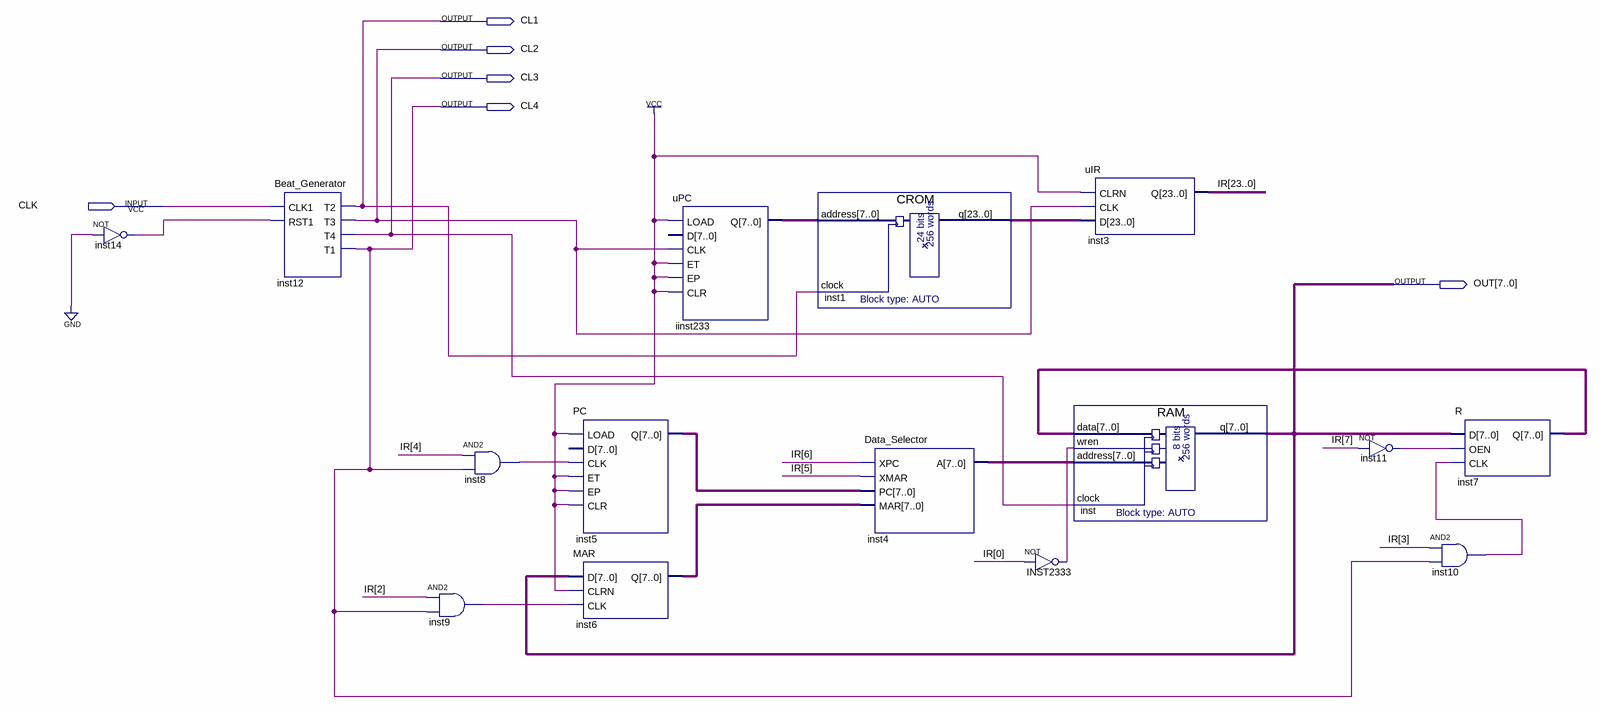
[diagram p0: schematic sheet]
// Quartus schematic Lab_2.bdf as structural Verilog: 15 symbols, 6 pins
module Lab_2 (
  input  CLK,
  output CL1,
  output CL2,
  output CL3,
  output CL4,
  output [7:0] OUT
);

  wire inst8_out, inst9_out, inst10_out, inst11_out, inst14_out, INST2333_out;
  wire [7:0] iinst233_q, inst4_a, inst5_q, inst6_q, inst7_q;
  wire [23:0] inst1_q, IR;

  not inst14 (inst14_out, 1'b0);
  Beat_Generator inst12 (.CLK1(CLK), .RST1(inst14_out), .T2(CL1), .T3(CL2), .T4(CL3), .T1(CL4));
  and inst9 (inst9_out, IR[2], CL4);
  and inst8 (inst8_out, IR[4], CL4);
  PC inst5 (.LOAD(1'b1), .CLK(inst8_out), .ET(1'b1), .EP(1'b1), .CLR(1'b1), .Q(inst5_q));  // open: D
  MAR inst6 (.D(OUT), .CLRN(1'b1), .CLK(inst9_out), .Q(inst6_q));
  uPC iinst233 (.LOAD(1'b1), .CLK(CL2), .ET(1'b1), .EP(1'b1), .CLR(1'b1), .Q(iinst233_q));  // open: D
  CROM inst1 (.address(iinst233_q), .clock(CL1), .q(inst1_q));
  Data_Selector inst4 (.XPC(IR[6]), .XMAR(IR[5]), .PC(inst5_q), .MAR(inst6_q), .A(inst4_a));
  not INST2333 (INST2333_out, IR[0]);
  uIR inst3 (.CLRN(1'b1), .CLK(CL2), .D(inst1_q), .Q(IR));
  RAM inst (.data(inst7_q), .wren(INST2333_out), .address(inst4_a), .clock(CL3), .q(OUT));
  not inst11 (inst11_out, IR[7]);
  R inst7 (.D(OUT), .OEN(inst11_out), .CLK(inst10_out), .Q(inst7_q));
  and inst10 (inst10_out, IR[3], CL4);
endmodule
